# EAGLE design Printrhub_Rev_0.4 (EAGLE 7.5.0)
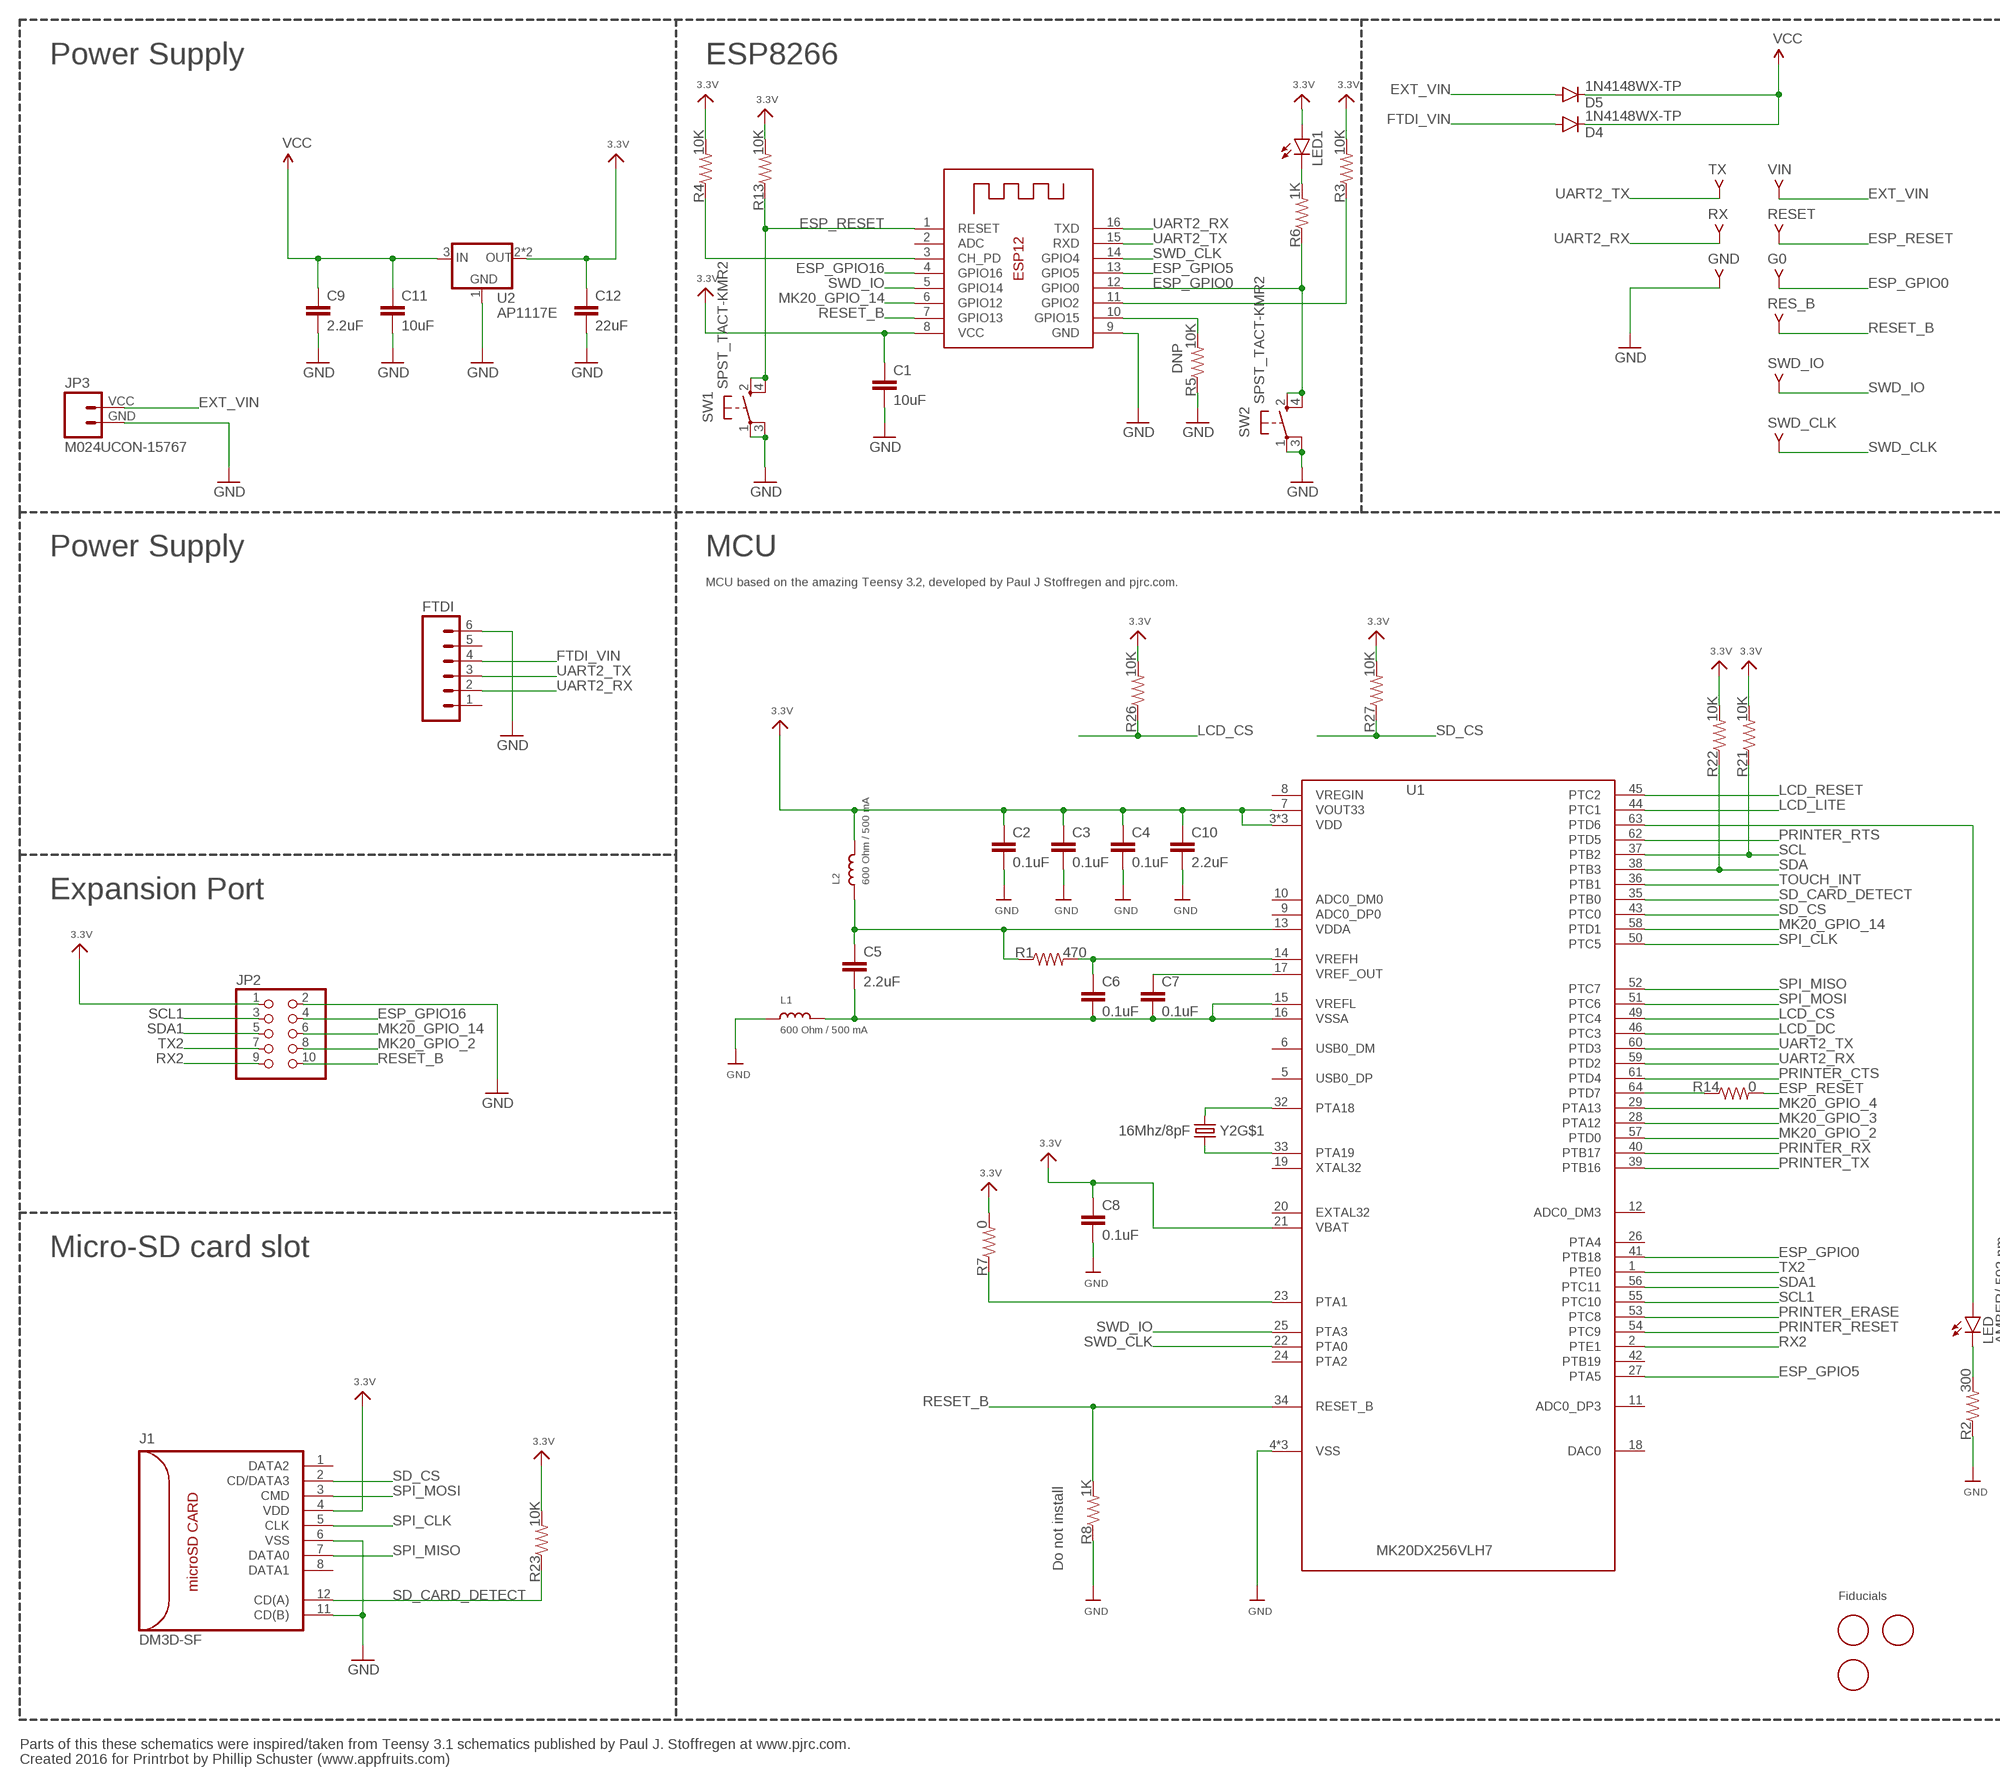
[diagram p0: schematic, sheet 1, part 1 of 2]
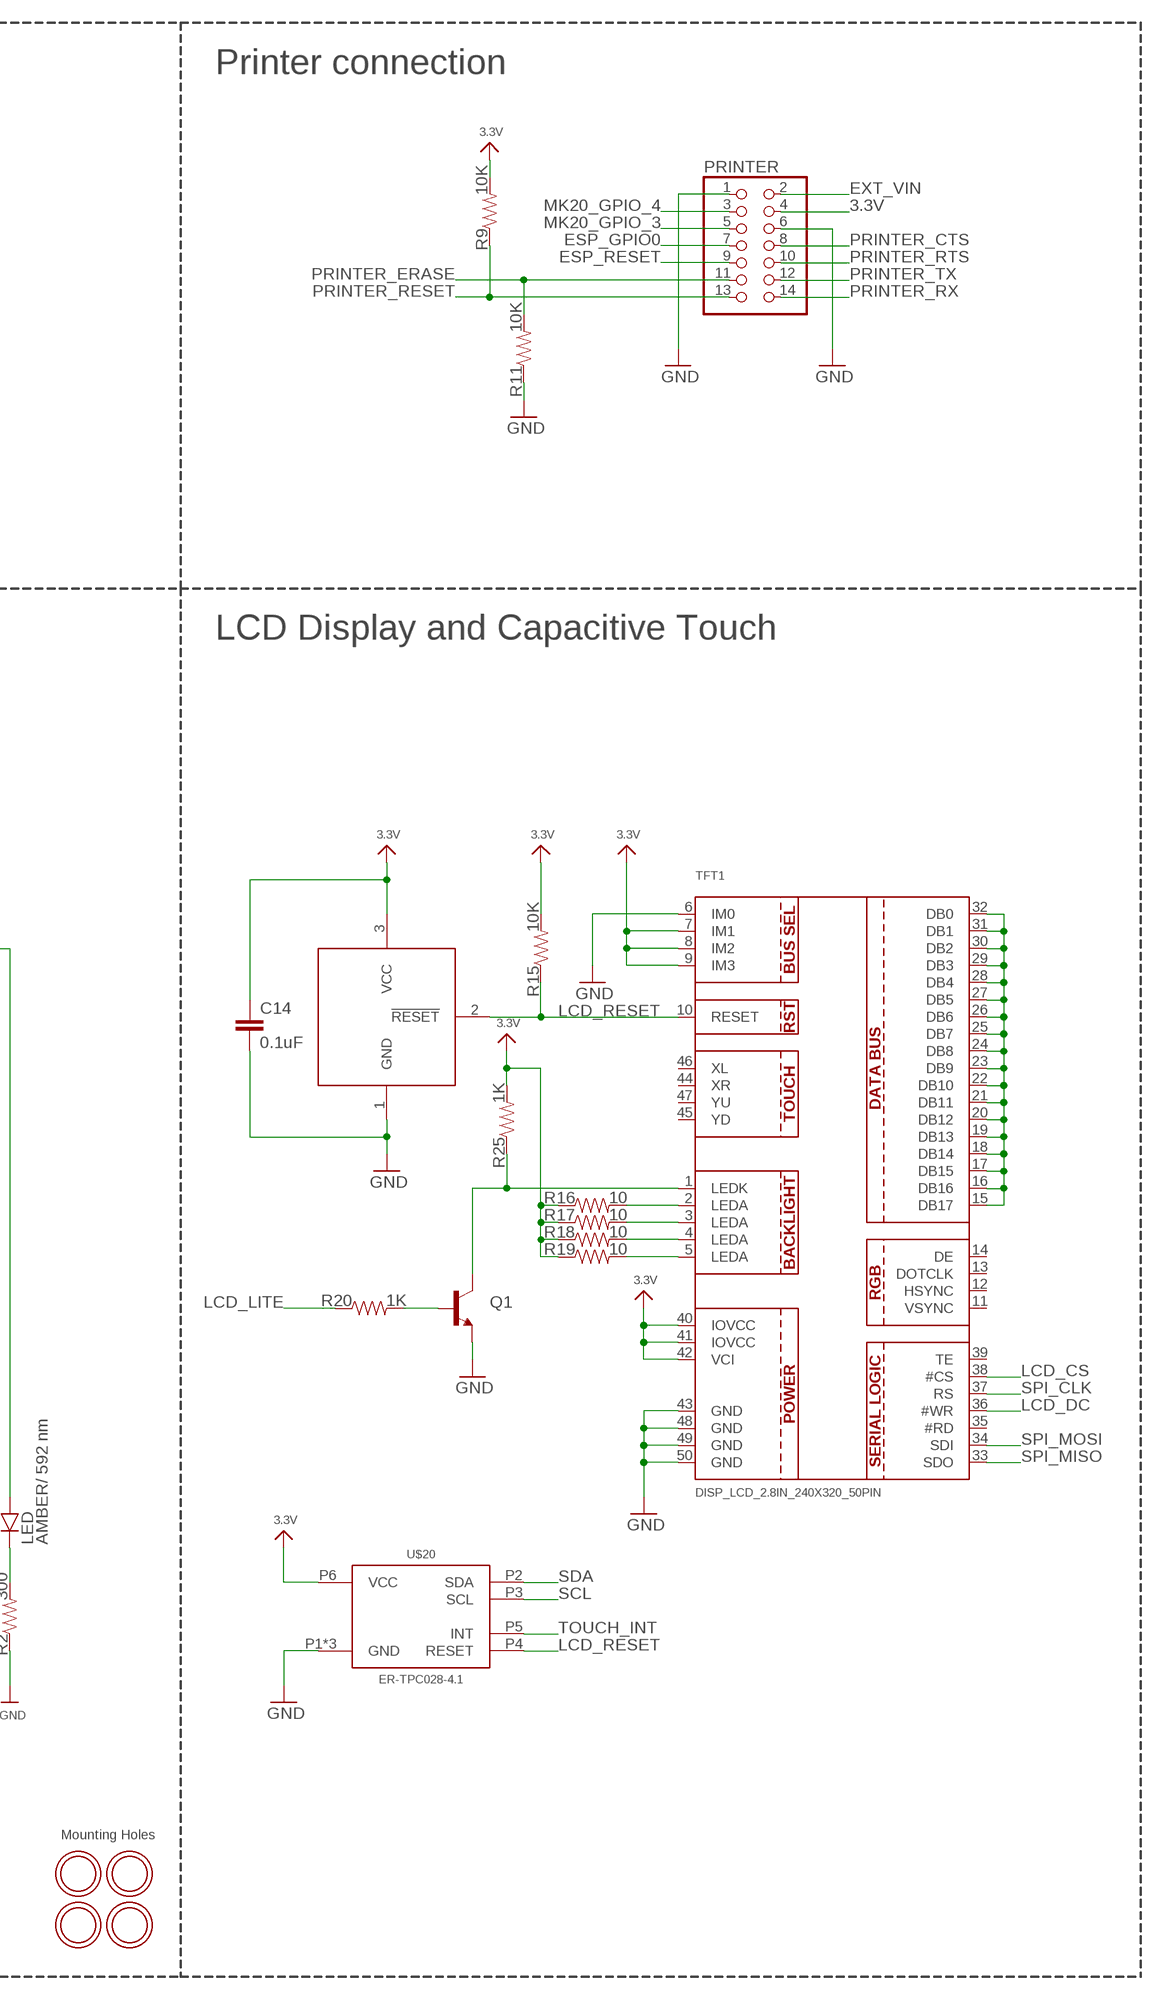
[diagram p1: schematic, sheet 1, part 2 of 2]

## Parts
C1  10uF  CAPACITOR-10UF  [0603-CAP]
C2  0.1uF  CAPACITOR-0.1UF  [0603-CAP]
C3  0.1uF  CAPACITOR-0.1UF  [0603-CAP]
C4  0.1uF  CAPACITOR-0.1UF  [0603-CAP]
C5  2.2uF  CAPACITOR-2.2UF  [0603-CAP]
C6  0.1uF  CAPACITOR-0.1UF  [0603-CAP]
C7  0.1uF  CAPACITOR-0.1UF  [0603-CAP]
C8  0.1uF  CAPACITOR-0.1UF  [0603-CAP]
C9  2.2uF  CAPACITOR-2.2UF  [0603-CAP]
C10  2.2uF  CAPACITOR-2.2UF  [0603-CAP]
C11  10uF  CAPACITOR-10UF  [0603-CAP]
C12  22uF  CAPACITOR-22UF  [0603-CAP]
C14  0.1uF  CAPACITOR-0.1UF  [0603-CAP]
D4  1N4148WX-TP  DIODESOD  [SOD-323]
D5  1N4148WX-TP  DIODESOD  [SOD-323]
FTDI  M06SMD-STRAIGHT-ALT  [1X06_SMD_STRAIGHT_ALT]
G0  TPV-SMD-18RN  [SMD-18RN]
GND  TPV-SMD-18RN  [SMD-18RN]
J1  DM3D-SF  [DM3D-SF]
JP2  PINHD-2X5SMT  [2X05_SMT]
JP3  M024UCON-15767  [JST-2-SMD-VERT]
L1  600 Ohm / 500 mA  INDUCTOR-0603_600OHM/500MA  [0603]
L2  600 Ohm / 500 mA  INDUCTOR-0603_600OHM/500MA  [0603]
LED  AMBER/ 592 nm  LED-AMBER  [LED-0603]
LED1  LED-GREEN  [LED-0603]
PRINTER  PINHD-2X7SMT  [2X07_SMT]
Q1  TRANSISTOR_NPNSOT23-3  [SOT23-3]
R1  470  RESISTOR-470  [0603-RES]
R2  300  RESISTOR0603  [0603-RES]
R3  10K  RESISTOR-10K  [0603-RES]
R4  10K  RESISTOR-10K  [0603-RES]
R5  10K  RESISTOR-10K  [0603-RES]
R6  1K  RESISTOR-1K  [0603-RES]
R7  0  RESISTOR-0  [0603-RES]
R8  1K  RESISTOR-1K  [0603-RES]
R9  10K  RESISTOR-10K  [0603-RES]
R11  10K  RESISTOR-10K  [0603-RES]
R13  10K  RESISTOR-10K  [0603-RES]
R14  0  RESISTOR-0  [0603-RES]
R15  10K  RESISTOR-10K  [0603-RES]
R16  10  RESISTOR-10  [0603-RES]
R17  10  RESISTOR-10  [0603-RES]
R18  10  RESISTOR-10  [0603-RES]
R19  10  RESISTOR-10  [0603-RES]
R20  1K  RESISTOR-1K  [0603-RES]
R21  10K  RESISTOR-10K  [0603-RES]
R22  10K  RESISTOR-10K  [0603-RES]
R23  10K  RESISTOR-10K  [0603-RES]
R25  1K  RESISTOR-1K  [0603-RES]
R26  10K  RESISTOR-10K  [0603-RES]
R27  10K  RESISTOR-10K  [0603-RES]
RES_B  TPV-SMD-18RN  [SMD-18RN]
RESET  TPV-SMD-18RN  [SMD-18RN]
RX  TPV-SMD-18RN  [SMD-18RN]
SW1  SPST_TACT-KMR2  [KMR2]
SW2  SPST_TACT-KMR2  [KMR2]
SWD_CLK  TPV-SMD-18RN  [SMD-18RN]
SWD_IO  TPV-SMD-18RN  [SMD-18RN]
TFT1  DISP_LCD_2.8IN_240X320_50PIN  [TFT_2.83IN_240X320_50PIN]
TX  TPV-SMD-18RN  [SMD-18RN]
U1  MK20DX256VLH7  [MK20DX256VLH7]
U2  AP1117E  [SOT223]
U3  MAX308-SOT23  [SOT23]
U$15  MOUNTINGHOLE  [HOLE_M3.0]
U$16  MOUNTINGHOLE  [HOLE_M3.0]
U$17  MOUNTINGHOLE  [HOLE_M3.0]
U$18  MOUNTINGHOLE  [HOLE_M3.0]
U$20  ER-TPC028-4.1  [ER-CON06HB-1]
U$38  FIDUCIAL  [FIDUCIAL_1MM]
U$39  FIDUCIAL  [FIDUCIAL_1MM]
U$40  FIDUCIAL  [FIDUCIAL_1MM]
VIN  TPV-SMD-18RN  [SMD-18RN]
X1  ESP-12  [ESP-12]
Y2  16Mhz/8pF  CRYSTAL/SMD-5X3-GND16MHZ/8PF  [CRYSTAL-SMD-5X3]

## Nets
3.3V: C1.1 C2.1 C3.1 C4.1 C8.1 C10.1 C12.1 C14.1 J1.4(VDD) JP2.1 L2.2 LED1.A PRINTER.4 R3.2 R4.2 R7.2 R9.2 R13.2 R15.2 R16.1 R17.1 R18.1 R19.1 R21.2 R22.2 R23.2 R25.2 R26.2 R27.2 TFT1.7(IM1) TFT1.8(IM2) TFT1.9(IM3) TFT1.40(IOVCC) TFT1.41(IOVCC) TFT1.42(VCI) U1.3(VDD) U1.7(VOUT33) U1.21(VBAT) U1.30(VDD) U1.48(VDD) U2.2(OUT) U2.4(OUT) U3.3(VCC) U$20.P6(VCC) X1.8(VCC)
ESP_GPIO0: G0.TP PRINTER.7 R6.1 SW2.2(S) SW2.4(S1) U1.41(PTB18) X1.12(GPIO0)
ESP_GPIO5: U1.27(PTA5) X1.13(GPIO5)
ESP_GPIO16: JP2.4 X1.4(GPIO16)
ESP_RESET: PRINTER.9 R13.1 R14.2 RESET.TP SW1.2(S) SW1.4(S1) X1.1(RESET)
EXT_VIN: D5.A JP3.VCC PRINTER.2 VIN.TP
FTDI_VIN: D4.A FTDI.4
GND [Top GND Pour]: C1.2 C2.2 C3.2 C4.2 C8.2 C9.2 C10.2 C11.2 C12.2 C14.2 FTDI.6 GND.TP J1.6(VSS) J1.11(CD(B)) JP2.2 JP3.GND L1.1 PRINTER.1 PRINTER.6 Q1.2(E) R2.1 R5.1 R8.1 R11.1 SW1.1(P) SW1.3(P1) SW2.1(P) SW2.3(P1) TFT1.6(IM0) TFT1.43(GND) TFT1.48(GND) TFT1.49(GND) TFT1.50(GND) U1.4(VSS) U1.31(VSS) U1.47(VSS) U2.1(GND) U3.1(GND) U$20.P1(GND) U$20.PAD@0(GND) U$20.PAD@1(GND) X1.9(GND)
LCD_CS: R26.1 TFT1.38(#CS) U1.49(PTC4)
LCD_DC: TFT1.36(#WR) U1.46(PTC3)
LCD_LITE: R20.1 U1.44(PTC1)
LCD_RESET: R15.1 TFT1.10(RESET) U1.45(PTC2) U3.2(!RESET) U$20.P4(RESET)
MK20_GPIO_2: JP2.8 U1.57(PTD0)
MK20_GPIO_3: PRINTER.5 U1.28(PTA12)
MK20_GPIO_4: PRINTER.3 U1.29(PTA13)
MK20_GPIO_14: JP2.6 U1.58(PTD1) X1.6(GPIO12)
N$1: R14.1 U1.64(PTD7)
N$2: R5.2 X1.10(GPIO15)
N$3: R7.1 U1.23(PTA1)
N$4: R3.1 X1.11(GPIO2)
N$5: R4.1 X1.3(CH_PD)
N$7: LED1.C R6.2
N$10: Q1.3(C) R25.1 TFT1.1(LEDK)
N$11: R16.2 TFT1.2(LEDA)
N$12: LED.A U1.63(PTD6)
N$13: R17.2 TFT1.3(LEDA)
N$14: R18.2 TFT1.4(LEDA)
N$15: R19.2 TFT1.5(LEDA)
N$16: Q1.1(B) R20.2
N$17: TFT1.15(DB17) TFT1.16(DB16) TFT1.17(DB15) TFT1.18(DB14) TFT1.19(DB13) TFT1.20(DB12) TFT1.21(DB11) TFT1.22(DB10) TFT1.23(DB9) TFT1.24(DB8) TFT1.25(DB7) TFT1.26(DB6) TFT1.27(DB5) TFT1.28(DB4) TFT1.29(DB3) TFT1.30(DB2) TFT1.31(DB1) TFT1.32(DB0)
N$18: LED.C R2.2
N$27: U1.32(PTA18) Y2.3
N$28: U1.33(PTA19) Y2.1
PRINTER_CTS: PRINTER.8 U1.61(PTD4)
PRINTER_ERASE: PRINTER.11 R11.2 U1.53(PTC8)
PRINTER_RESET: PRINTER.13 R9.1 U1.54(PTC9)
PRINTER_RTS: PRINTER.10 U1.62(PTD5)
PRINTER_RX: PRINTER.14 U1.40(PTB17)
PRINTER_TX: PRINTER.12 U1.39(PTB16)
RESET_B: JP2.10 R8.2 RES_B.TP U1.34(RESET_B) X1.7(GPIO13)
RX2: JP2.9 U1.2(PTE1)
SCL: R21.1 U1.37(PTB2) U$20.P3(SCL)
SCL1: JP2.3 U1.55(PTC10)
SD_CARD_DETECT: J1.12(CD(A)) R23.1 U1.35(PTB0)
SD_CS: J1.2(CD/DATA3) R27.1 U1.43(PTC0)
SDA: R22.1 U1.38(PTB3) U$20.P2(SDA)
SDA1: JP2.5 U1.56(PTC11)
SPI_CLK: J1.5(CLK) TFT1.37(RS) U1.50(PTC5)
SPI_MISO: J1.7(DATA0) TFT1.33(SDO) U1.52(PTC7)
SPI_MOSI: J1.3(CMD) TFT1.34(SDI) U1.51(PTC6)
SWD_CLK: SWD_CLK.TP U1.22(PTA0) X1.14(GPIO4)
SWD_IO: SWD_IO.TP U1.25(PTA3) X1.5(GPIO14)
TOUCH_INT: U1.36(PTB1) U$20.P5(INT)
TX2: JP2.7 U1.1(PTE0)
UART2_RX: FTDI.2 RX.TP U1.59(PTD2) X1.16(TXD)
UART2_TX: FTDI.3 TX.TP U1.60(PTD3) X1.15(RXD)
VCC: C9.1 C11.1 D4.C D5.C U2.3(IN)
VDDA: C5.1 L2.1 R1.1 U1.13(VDDA)
VREF_OUT: C7.1 U1.17(VREF_OUT)
VREFH: C6.1 R1.2 U1.14(VREFH)
VREFL: C5.2 C6.2 C7.2 L1.2 U1.15(VREFL) U1.16(VSSA)
Unconnected: FTDI.1 FTDI.5 J1.1(DATA2) J1.8(DATA1) J1.9(GND) J1.10(GND) J1.13(GND) J1.14(GND) TFT1.11(VSYNC) TFT1.12(HSYNC) TFT1.13(DOTCLK) TFT1.14(DE) TFT1.35(#RD) TFT1.39(TE) TFT1.44(XR) TFT1.45(YD) TFT1.46(XL) TFT1.47(YU) U1.5(USB0_DP) U1.6(USB0_DM) U1.8(VREGIN) U1.9(ADC0_DP0) U1.10(ADC0_DM0) U1.11(ADC0_DP3) U1.12(ADC0_DM3) U1.18(DAC0) U1.19(XTAL32) U1.20(EXTAL32) U1.24(PTA2) U1.26(PTA4) U1.42(PTB19) X1.2(ADC) Y2.2(GND:GND) Y2.4(GND:GND)

## Notes on the sheet
- Power Supply | ESP8266 | Printer connection
- DNP
- Power Supply | MCU | LCD Display and Capacitive Touch
- MCU based on the amazing Teensy 3.2, developed by Paul J Stoffregen and pjrc.com.
- Expansion Port
- Micro-SD card slot
- Do not install
- Fiducials | Mounting Holes
- Parts of this these schematics were inspired/taken from Teensy 3.1 schematics published by Paul J. Stoffregen at www.pjrc.com.
- Created 2016 for Printrbot by Phillip Schuster (www.appfruits.com)

## Library data of the parts
C1 C11 = appfruits:CAPACITOR; MF: Murata; MPN: GRM188R60J106ME47D
C2-C4 C6-C8 C14 = appfruits:CAPACITOR; MF: Kemet; MPN: C0603C104J3RACTU
C5 C9 C10 = appfruits:CAPACITOR; MF: Kemet; MPN: C0603C225K4PACTU
C12 = appfruits:CAPACITOR; MF: Murata; MPN: GRM188R60J226MEA0D
D4 D5 = SparkFun-DiscreteSemi:DIODE: Diode These are standard reverse protection diodes and small signal diodes. SMA package can handle up to about 1A. SOD-323 can handle about 200mA. What the SOD-323 package when ordering, there are some mfgs out there that are 5-pin packages.; MF: Micro Commercial Co; MPN: 1N4148WX-TP; PROD_ID: DIO-09646
FTDI = appfruits:M06: Header 6 Standard 6-pin 0.1" header. Use with straight break away headers (SKU : PRT-00116), right angle break away headers (PRT-00553), swiss pins (PRT-00743), machine pins (PRT-00117), and female headers (PRT-00115). Molex polarized connector foot print use with SKU : PRT-08094 with associated crimp pins and housings. NOTES ON THE VARIANTS LOCK and LOCK_LONGPADS... This footprint was designed to help hold the alignment of a through-hole component (i.e. 6-pin header) while soldering it into place. You may notice that each hole has been shifted either up or down by 0.005 of an inch from it's more standard position (which is a perfectly straight line). This slight alteration caused the pins (the squares in the middle) to touch the edges of the holes. Because they are alternating, it causes a "brace" to hold the component in place. 0.005 has proven to be the perfect amount of "off-center" position when using our standard breakaway headers. Although looks a little odd when you look at the bare footprint, once you have a header in there, the alteration is very hard to notice. Also,if you push a header all the way into place, it is covered up entirely on the bottom side. This idea of altering the position of holes to aid alignment will be further integrated into the Sparkfun Library for other footprints. It can help hold any component with 3 or more connection pins.
G0 GND RES_B RESET RX SWD_CLK SWD_IO TX VIN = appfruits:TPV: TEST POINT PAD; BOM: EXCLUDE
J1 = con-sd-card:DM3D-SF: MICRO SD CONNECTOR
JP2 = pinhead+:PINHD-2X5: PIN HEADER
JP3 = SparkFun-Connectors:M02: Standard 2-pin 0.1" header. Use with - straight break away headers ( PRT-00116) - right angle break away headers (PRT-00553) - swiss pins (PRT-00743) - machine pins (PRT-00117) - female headers (PRT-00115) Molex polarized connector foot print use with: PRT-08233 with associated crimp pins and housings. 2.54_SCREWTERM for use with PRT-10571. 3.5mm Screw Terminal footprints for PRT-08084 5mm Screw Terminal footprints for use with PRT-08432
L1 L2 = appfruits:INDUCTOR: Inductors 0603: 10nH Ceramic Inductor - microwire antenna/RF (Digikey: 712-1434-2-ND) 0805: 560nH Ceramic Inductor - RF (Digikey: 553-1047-1-ND) 270nH Ceramic Inductor - Q = 40@250MHz, +-5%, 1 Ohm DC Resistance (Digikey: 535-10506-2-ND) 1007 (2518 Metric) SMT: 10µH 10% 250mOhm 820mA 1007 Inductor (Digikey: 587-2189-1-ND) 22µH 10% 500mOhm 580mA 1007 Inductor (Digikey: 587-2190-1-ND) 47µH 10% 950mOhm 420mA 1007 Inductor (Digikey: 587-2191-1-ND) 47µH 5% 100mOhm 1A 1008 Inductor (Digikey: 732-1816-1-ND) 5.0x5.0mm (Taiyo Yuden NR5040 Series) 6.8µH 20% 2.3A 64mOhm Inductor (Digikey: 587-2374-2-ND) 5.0x5.0mm (TDK VLC5045 Series) 4.7µH 20% 3.3A 34mOhm Inductor (Digikey: 445-6526-1-ND) 6.8µH 20% 2.7A 46mOhm Inductor (Digikey: 445-6527-1-ND) 6.0x6.0mm (TDK VLC6045 Series) 4.7µH 20% 3.8A 27mOhm Inductor (Digikey: 445-6538-2-ND) 6.8µH 20% 3A 41mOhm Inductor (Digikey: 445-6540-1-ND) 6.2µH 30% 2.2A 45mOhm Inductor (Digikey: SRR5028-6R2YCT-ND) - Not TDK VLC6045 but footprint should match 6.0x6.0mm (TDK SLF6045 Series) 6.8uH 30% 2A 33mOhm Inductor (Digikey: 445-4572-1-ND, Mouser: 810-SLF645T6R8N2R0PF) 6.0x6.0mm (Sumida CDRH5D28 Series) 6.2uH 30% 1.8A 45mOhm Inductor (Digikey: 308-1542-1-ND) Taiyo Yuden NR3015T2R2M - 2.2uH 20% 1.5A (Digikey: 587-1648-2-ND, Mouser: 963-NR3015T2R2M) - Used with TI TPS62172 CoilCraft RFID Transponder Coil - MA5532-AE (For use with AS3935 Lightning Sensor); MF: Murata; MPN: BLM18AG601SN1D
LED = appfruits:LED: LEDs Standard schematic elements and footprints for 5mm, 3mm, 1206, and 0603 sized LEDs. 5mm - Spark Fun Electronics SKU : COM-00529 (and others); MF: Avago Technologies; MPN: HSMA-C190
LED1 = appfruits:LED: LEDs Standard schematic elements and footprints for 5mm, 3mm, 1206, and 0603 sized LEDs. 5mm - Spark Fun Electronics SKU : COM-00529 (and others); MF: Avago; MPN: HSMG-C190
PRINTER = pinhead+:PINHD-2X7: PIN HEADER
Q1 = appfruits:TRANSISTOR_NPN: Generic NPN BJT MMBT2222A - TRANS-08049 (SOT-23, 1A 40V) MPSA42 - TRANS-09116 (SOT-23, 500mA 300V) MMBT5088LT1G - TRANS-11160 (SOT-23, 50 mA 30V) BC547 - COM-08928 <http://www.sparkfun.com/products/8928> (TO-92 45V 100mA) (1.Collector 2.Base 3.Emitter) 2N3904 - COM-00521 <http://www.sparkfun.com/products/521> (TO-92 40V 200mA) (1.Emitter 2.Base 3.Collector) P2N2222A - COM-12852 <http://www.sparkfun.com/products/12852> (TO-92 40V 600mA) (1.Collector 2.Base 3.Emitter); MF: ON Semiconductor; MPN: MMBT2222ALT1G
R1 = appfruits:RESISTOR: Resistor Basic schematic elements and footprints for 0603, 1206, and PTH resistors.; MF: Panasonic; MPN: ERJ-3GEYJ471V
R2 = appfruits:RESISTOR: Resistor Basic schematic elements and footprints for 0603, 1206, and PTH resistors.
R3-R5 R9 R11 R13 R15 R21-R23 R26 R27 = appfruits:RESISTOR: Resistor Basic schematic elements and footprints for 0603, 1206, and PTH resistors.; MF: Panasonic; MPN: ERJ-3GEYJ103V
R6 R8 R20 R25 = appfruits:RESISTOR: Resistor Basic schematic elements and footprints for 0603, 1206, and PTH resistors.; MF: Panasonic; MPN: ERJ-3GEYJ102V
R7 R14 = appfruits:RESISTOR: Resistor Basic schematic elements and footprints for 0603, 1206, and PTH resistors.; MF: Panasonic; MPN: ERJ-3GEY0R00V
R16-R19 = appfruits:RESISTOR: Resistor Basic schematic elements and footprints for 0603, 1206, and PTH resistors.; MF: Panasonic; MPN: ERJ-3EKF10R0V
SW1 SW2 = adafruit:SPST_TACT: SMT 6mm switch, EVQQ2 series http://www.ladyada.net/library/eagle
TFT1 = appfruits:DISP_LCD_2.8IN_240X320_50PIN
U1 = appfruits:MK20DX256VLH7; MF: Freescale; MPN: MK20DX256VLH7
U2 = v-reg:AP1117: LDO Regulator
U3 = appfruits:MAX308: Reset Monitor for various drop voltages
U$15-U$18 = appfruits:MOUNTINGHOLE
U$20 = appfruits:ER-TPC028-4.1: Connector for ER-TFT028-4 capacitive touch screen controller (buydisplay.com)
U$38-U$40 = adafruit:FIDUCIAL: For use by pick and place machines to calibrate the vision/machine, 1mm By microbuilder.eu
X1 = adafruit:ESP-12
Y2 = appfruits:CRYSTAL/SMD-5X3-GND; MF: ECS; MPN: ECS-160-8-30B-CKM

## Net classes
1 USB: width 0.267 mm, drill 0.33 mm, clearance 0.159 mm
2 Top GND Pour: clearance 0.762 mm to class 1

## Board
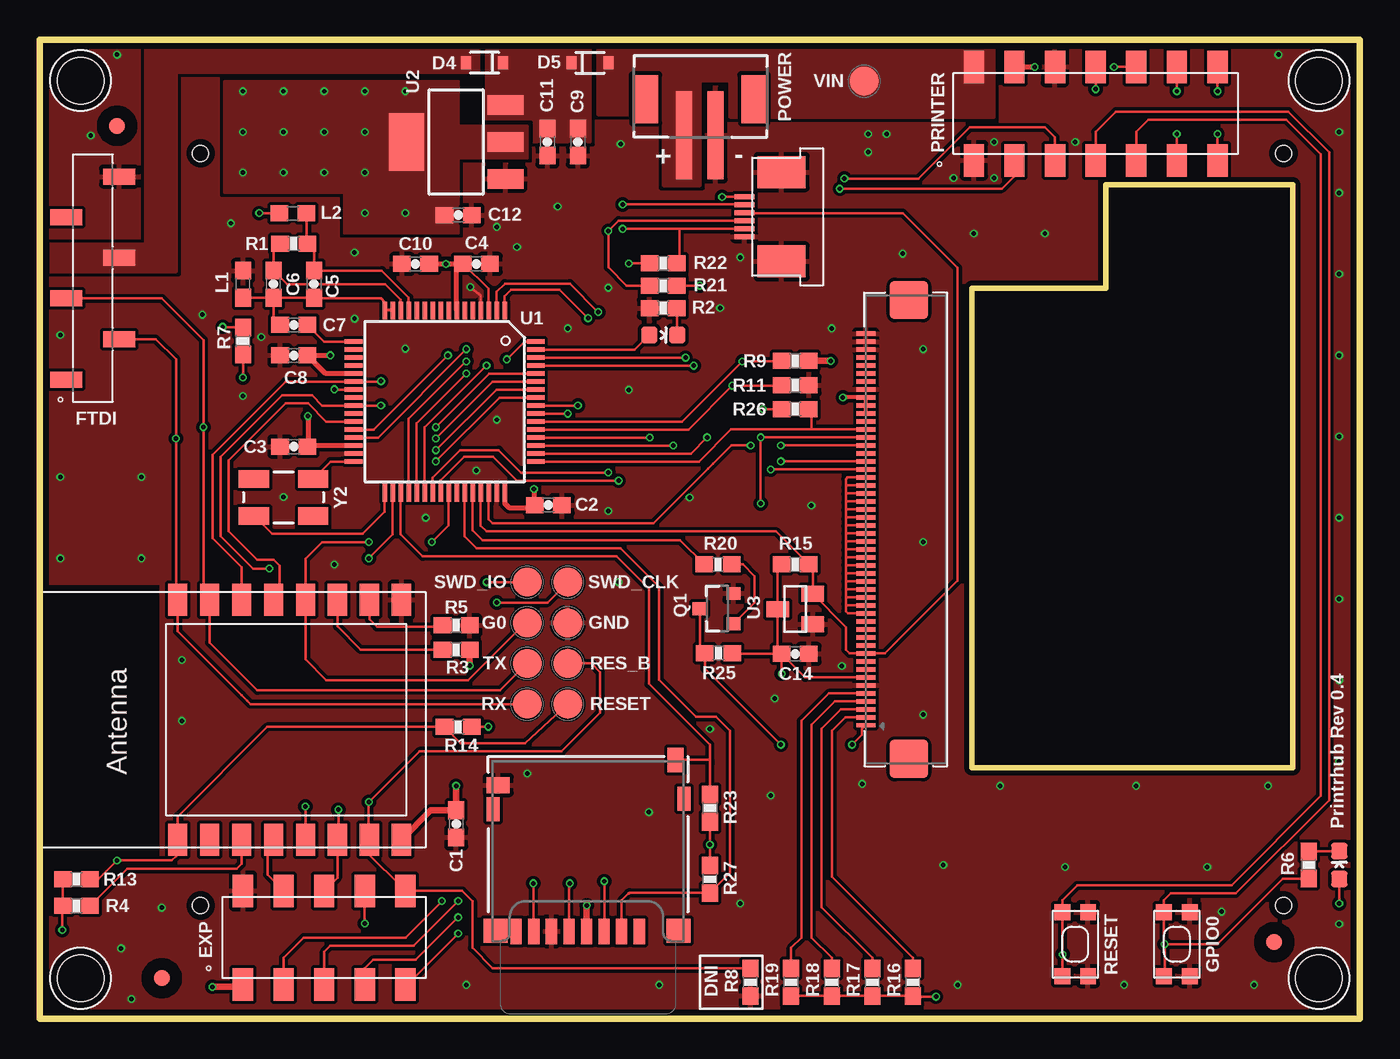
[diagram p2: board, top side]
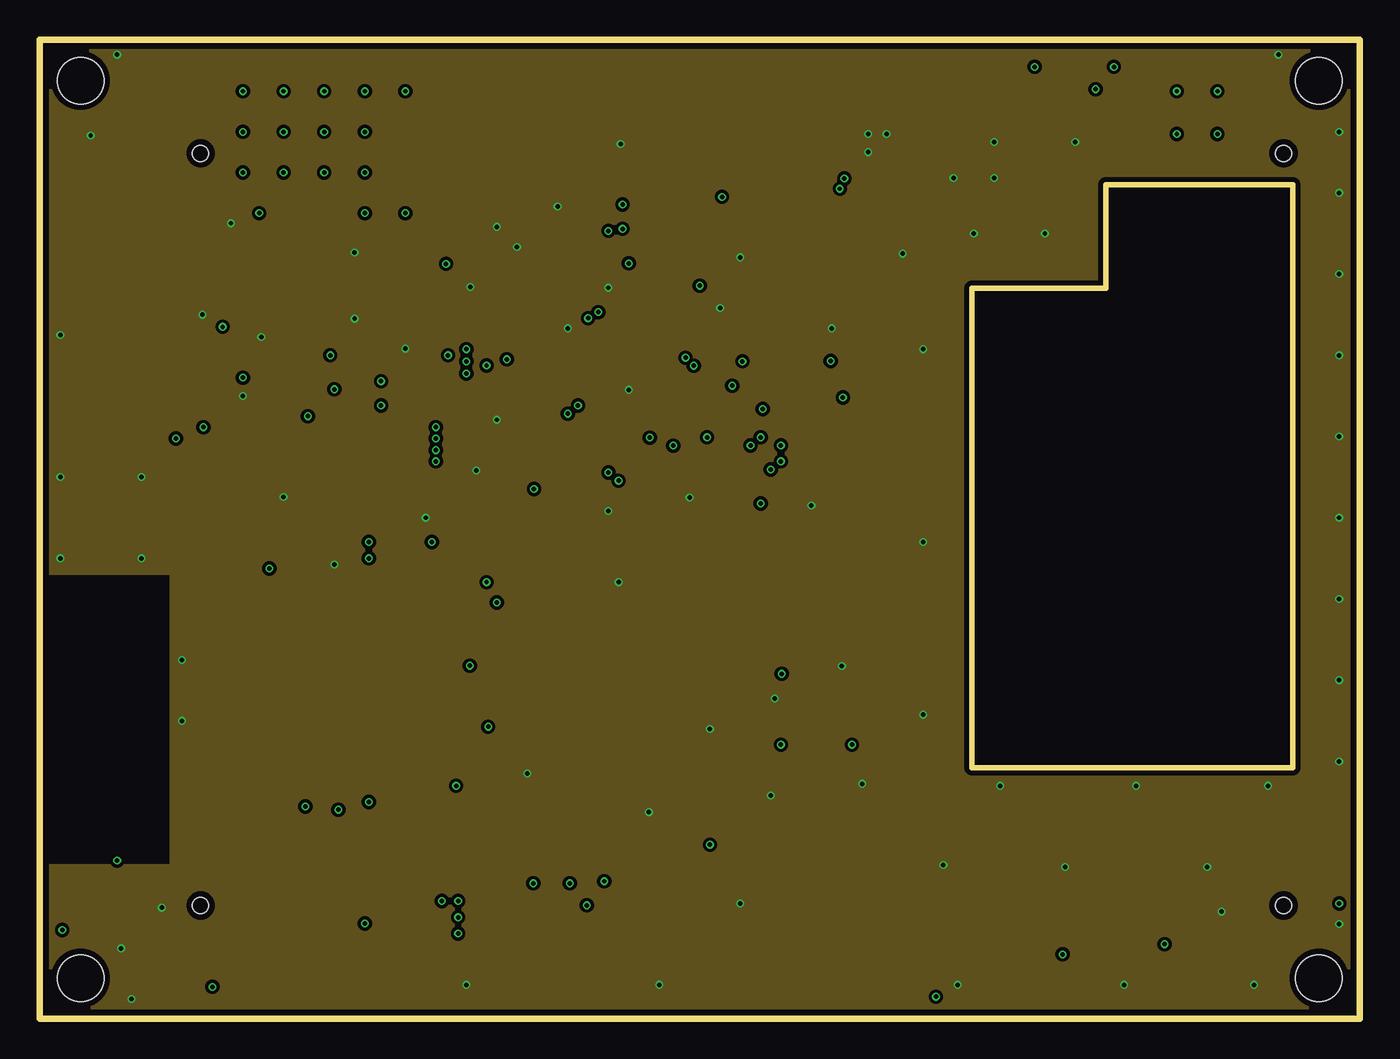
[diagram p3: board, inner layer GND]
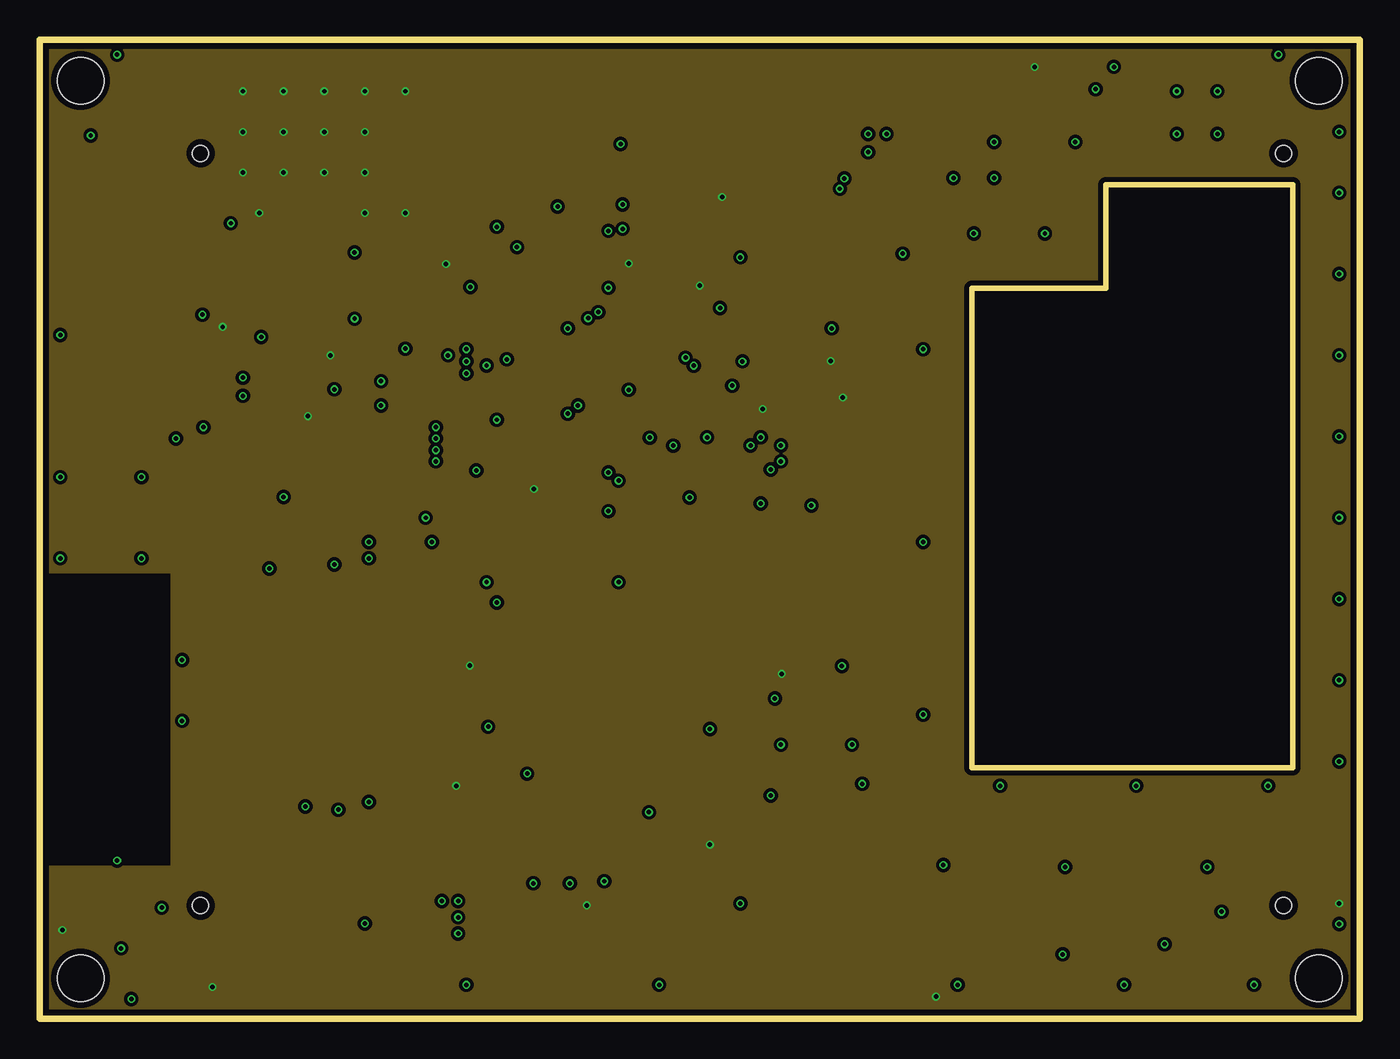
[diagram p4: board, inner layer 3V3]
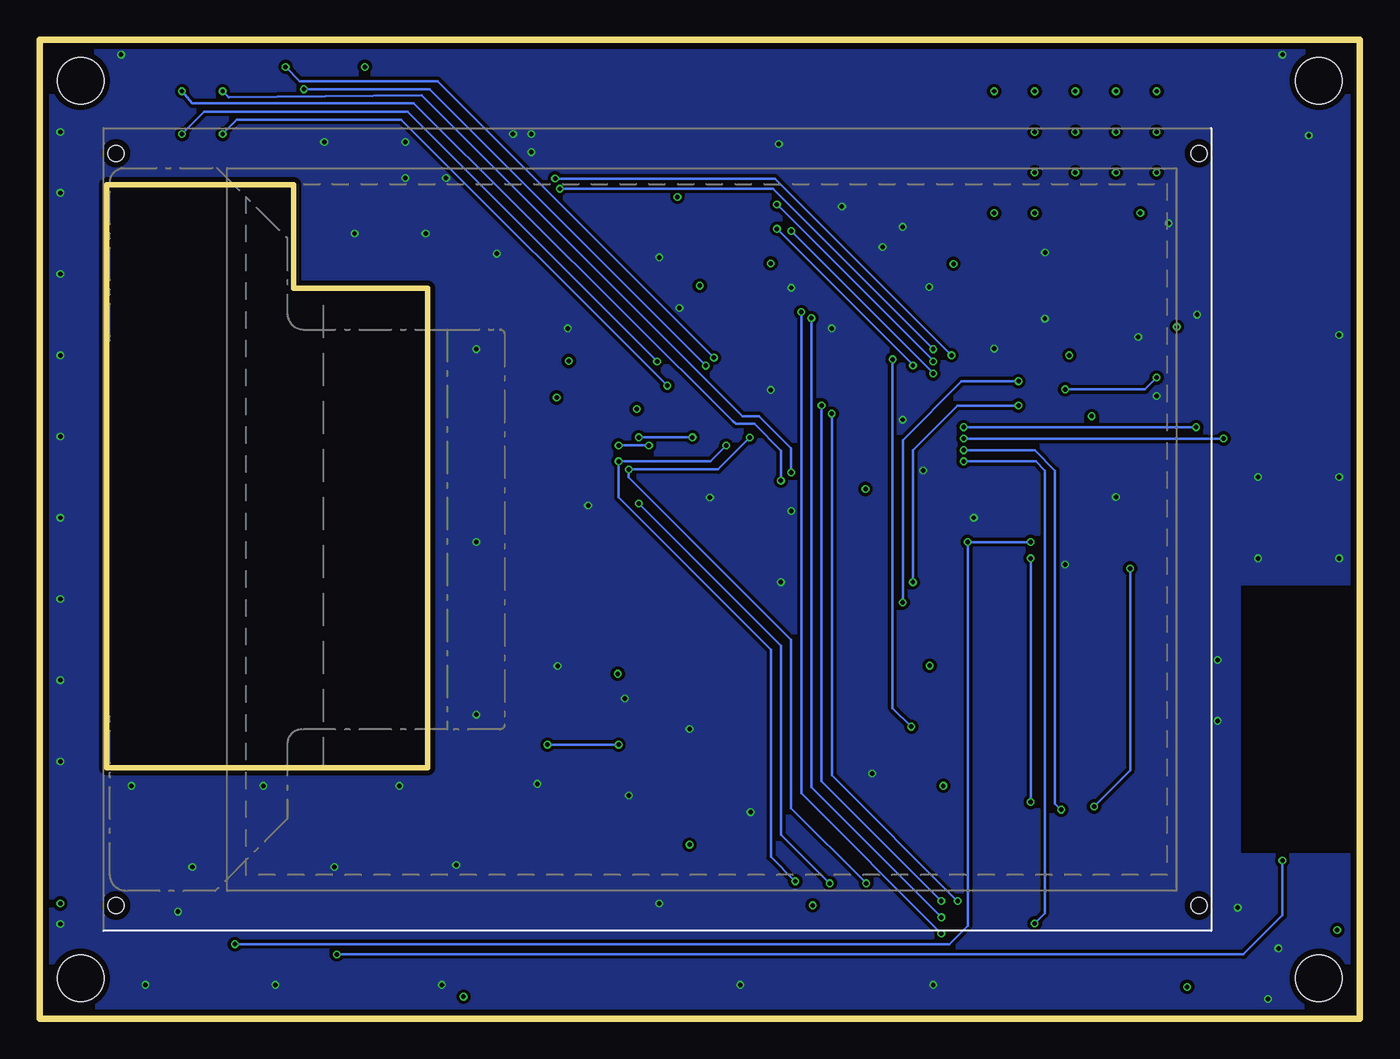
[diagram p5: board, bottom side, seen from below]

Size 82.55 x 61.21 mm. Coordinates in mm from the lower left corner, seen from the top.
Outline: 0,0 82.55,0 82.55,61.21 0,61.21 0,0
Outline: 58.29,15.72 78.36,15.72 78.36,52.16 66.67,52.16 66.67,45.69 58.29,45.69 58.29,15.72
Copper layers (1*2*15*16): Top 0.035559375mm / dielectric 0.17018125mm / GND 0.01778125mm / dielectric 47mil / 3V3 0.01778125mm / dielectric 0.17018125mm / Bottom 0.035559375mm
Design rules "OSHPark-4layer *": minimum track width 5mil, minimum drill 10mil, track to track 5mil, track to pad 5mil, pad to pad 5mil, via to via 5mil, smd to smd 5mil, copper to edge 15mil, drill to drill 6mil, minimum pad ring 4mil, minimum via ring 4mil, stop-mask expansion 4mil, vias tented up to drill 11mil, thermal gap 10mil
Milling: area 58.3,15.7 to 78.4,52.2

### Footprints (pad centres in the part's own frame; a part is rotated, then mirrored left to right if it is on the bottom)
0603-CAP = smd 1.1 x 1: 1 -0.85,0; 2 0.85,0
SOD-323 = smd 0.63 x 0.83: A 1.15,0; C -1.15,0
1X06_SMD_STRAIGHT_ALT = smd 1 x 2: 1 0,-1.65; 2 -2.54,1.65; 3 -5.08,-1.65; 4 -7.62,1.65; 5 -10.16,-1.65; 6 -12.7,1.65
SMD-18RN = smd 1.8 x 1.8: TP 0,0
DM3D-SF = smd 0.7 x 1.6: 1 3.2,0.8; 2 2.1,0.8; 3 1,0.8; 4 -0.1,0.8; 5 -1.2,0.8; 6 -2.3,0.8; 7 -3.4,0.8; 8 -4.5,0.8 | smd 1.5 x 1.5: 9 -5.8,0.85; 14 5.65,0.85 | smd 0.8 x 1.5: 10 -5.95,8.45; 13 6,9.1 | smd 1.45 x 1: 11 -5.625,9.95 | smd 1 x 1.55: 12 5.475,11.525
2X05_SMT = smd 1.27 x 2.032: 1 -5.08,-2.921; 2 -5.08,2.921; 3 -2.54,-2.921; 4 -2.54,2.921; 5 0,-2.921; 6 0,2.921; 7 2.54,-2.921; 8 2.54,2.921; 9 5.08,-2.921; 10 5.08,2.921
JST-2-SMD-VERT = smd 1 x 5.5: GND 1,-2; VCC -1,-2 | smd 1.6 x 3: P$1 -3.4,0.27; P$2 3.4,0.27
0603 = smd 1.1 x 1: 1 -0.85,0; 2 0.85,0
LED-0603 = smd 1 x 1: A 0,-0.877; C 0,0.877
2X07_SMT = smd 1.27 x 2.032: 1 -7.62,-2.921; 2 -7.62,2.921; 3 -5.08,-2.921; 4 -5.08,2.921; 5 -2.54,-2.921; 6 -2.54,2.921; 7 0,-2.921; 8 0,2.921; 9 2.54,-2.921; 10 2.54,2.921; 11 5.08,-2.921; 12 5.08,2.921; 13 7.62,-2.921; 14 7.62,2.921
SOT23-3 = smd 0.8 x 0.9: 1 -0.95,-1; 2 0.95,-1; 3 0,1.1
0603-RES = smd 1.1 x 1: 1 -0.85,0; 2 0.85,0
KMR2 = smd 1 x 1: 1 2,0.8; 2 2,-0.8; 3 -2,0.8; 4 -2,-0.8
TFT_2.83IN_240X320_50PIN = smd 0.275 x 1.2 bottom: 1 12.25,-10.39; 2 11.75,-10.39; 3 11.25,-10.39; 4 10.75,-10.39; 5 10.25,-10.39; 6 9.75,-10.39; 7 9.25,-10.39; 8 8.75,-10.39; 9 8.25,-10.39; 10 7.75,-10.39; 11 7.25,-10.39; 12 6.75,-10.39; 13 6.25,-10.39; 14 5.75,-10.39; 15 5.25,-10.39; 16 4.75,-10.39; 17 4.25,-10.39; 18 3.75,-10.39; 19 3.25,-10.39; 20 2.75,-10.39; 21 2.25,-10.39; 22 1.75,-10.39; 23 1.25,-10.39; 24 0.75,-10.39; 25 0.25,-10.39; 26 -0.25,-10.39; 27 -0.75,-10.39; 28 -1.25,-10.39; 29 -1.75,-10.39; 30 -2.25,-10.39; 31 -2.75,-10.39; 32 -3.25,-10.39; 33 -3.75,-10.39; 34 -4.25,-10.39; 35 -4.75,-10.39; 36 -5.25,-10.39; 37 -5.75,-10.39; 38 -6.25,-10.39; 39 -6.75,-10.39; 40 -7.25,-10.39; 41 -7.75,-10.39; 42 -8.25,-10.39; 43 -8.75,-10.39; 44 -9.25,-10.39; 45 -9.75,-10.39; 46 -10.25,-10.39; 47 -10.75,-10.39; 48 -11.25,-10.39; 49 -11.75,-10.39; 50 -12.25,-10.39 | smd 2.4 x 2.4 bottom: PAD1 14.35,-13.09; PAD2 -14.35,-13.09 | hole 1: 23.52,-36.525; 23.52,31.225; -23.52,31.225; -23.52,-36.525
MK20DX256VLH7 = smd 1.1 x 0.285: 1 -5.7,3.75; 2 -5.7,3.25; 3 -5.7,2.75; 4 -5.7,2.25; 5 -5.7,1.75; 6 -5.7,1.25; 7 -5.7,0.75; 8 -5.7,0.25; 9 -5.7,-0.25; 10 -5.7,-0.75; 11 -5.7,-1.25; 12 -5.7,-1.75; 13 -5.7,-2.25; 14 -5.7,-2.75; 15 -5.7,-3.25; 16 -5.7,-3.75; 33 5.7,-3.75; 34 5.7,-3.25; 35 5.7,-2.75; 36 5.7,-2.25; 37 5.7,-1.75; 38 5.7,-1.25; 39 5.7,-0.75; 40 5.7,-0.25; 41 5.7,0.25; 42 5.7,0.75; 43 5.7,1.25; 44 5.7,1.75; 45 5.7,2.25; 46 5.7,2.75; 47 5.7,3.25; 48 5.7,3.75 | smd 0.285 x 1.1: 17 -3.75,-5.7; 18 -3.25,-5.7; 19 -2.75,-5.7; 20 -2.25,-5.7; 21 -1.75,-5.7; 22 -1.25,-5.7; 23 -0.75,-5.7; 24 -0.25,-5.7; 25 0.25,-5.7; 26 0.75,-5.7; 27 1.25,-5.7; 28 1.75,-5.7; 29 2.25,-5.7; 30 2.75,-5.7; 31 3.25,-5.7; 32 3.75,-5.7; 49 3.75,5.7; 50 3.25,5.7; 51 2.75,5.7; 52 2.25,5.7; 53 1.75,5.7; 54 1.25,5.7; 55 0.75,5.7; 56 0.25,5.7; 57 -0.25,5.7; 58 -0.75,5.7; 59 -1.25,5.7; 60 -1.75,5.7; 61 -2.25,5.7; 62 -2.75,5.7; 63 -3.25,5.7; 64 -3.75,5.7
SOT223 = smd 1.219 x 2.235: 1 -2.311,-3.099; 2 0,-3.099; 3 2.311,-3.099 | smd 3.6 x 2.2: 4 0,3.099
SOT23 = smd 1 x 1.4: 1 -0.95,-1.1; 2 0.95,-1.1; 3 0,1.1
HOLE_M3.0 = hole 2.9: 0,0
ER-CON06HB-1 = smd 0.3 x 1.25: P1 -1.25,0; P2 -0.75,0; P3 -0.25,0; P4 0.25,0; P5 0.75,0; P6 1.25,0 | smd 2 x 3: PAD@0 -2.79,-2.325; PAD@1 2.79,-2.325
FIDUCIAL_1MM = smd 1 x 1: 1 0,0
ESP-12 = smd 2 x 1.2: 1 -7.5,4.5; 2 -7.5,2.5; 3 -7.5,0.5; 4 -7.5,-1.5; 5 -7.5,-3.5; 6 -7.5,-5.5; 7 -7.5,-7.5; 8 -7.5,-9.5; 9 7.5,-9.5; 10 7.5,-7.5; 11 7.5,-5.5; 12 7.5,-3.5; 13 7.5,-1.5; 14 7.5,0.5; 15 7.5,2.5; 16 7.5,4.5
CRYSTAL-SMD-5X3 = smd 1.9 x 1.1: 1 -1.85,-1.15; 2 1.85,-1.15; 3 1.85,1.15; 4 -1.85,1.15

### Placement (x,y rotation side)
C1  26.04,12.19 270 top
C2  31.8,32.12 0 top
C3  15.88,35.78 180 top
C4  27.3,47.21 0 top
C5  17.14,45.94 270 top
C6  14.61,45.94 270 top
C7  15.88,43.4 180 top
C8  15.88,41.5 180 top
C9  33.66,54.83 270 top
C10  23.5,47.21 180 top
C11  31.75,54.83 270 top
C12  26.16,50.26 0 top
C14  47.24,22.83 0 top
D4  27.81,59.78 180 top
D5  34.42,59.78 0 top
FTDI  3.3,39.97 270 top
G0  30.48,24.77 0 top
GND  33.02,24.77 0 top
J1  34.29,4.67 0 top
JP2  17.78,5.08 0 top
JP3  41.27,57.24 0 top
L1  12.7,45.94 270 top
L2  15.83,50.37 180 top
LED  38.99,42.77 270 top
LED1  81.28,9.62 0 top
PRINTER  66.04,56.61 0 top
Q1  42.39,25.65 90 top
R1  15.88,48.48 180 top
R2  38.99,44.45 0 top
R3  26.04,23.08 0 top
R4  2.29,7.08 180 top
R5  26.04,24.61 180 top
R6  79.38,9.62 90 top
R7  12.7,42.39 90 top
R8  44.45,2.29 90 top
R9  47.24,41.15 0 top
R11  47.24,39.62 180 top
R13  2.29,8.73 180 top
R14  26.16,18.26 180 top
R15  47.24,28.42 180 top
R16  54.61,2.29 90 top
R17  52.07,2.29 90 top
R18  49.53,2.29 90 top
R19  46.99,2.29 90 top
R20  42.42,28.42 0 top
R21  38.99,45.85 0 top
R22  38.99,47.24 180 top
R23  41.91,13.18 270 top
R25  42.45,22.86 0 top
R26  47.24,38.13 180 top
R27  41.91,8.73 90 top
RES_B  33.02,22.23 0 top
RESET  33.02,19.68 0 top
RX  30.48,19.68 0 top
SW1  64.77,4.67 270 top
SW2  71.12,4.67 270 top
SWD_CLK  33.02,27.3 0 top
SWD_IO  30.48,27.3 0 top
TFT1  41.27,30.61 270 bottom
TX  30.48,22.23 0 top
U1  25.32,38.6 270 top
U2  26.04,54.83 90 top
U3  47.24,25.62 90 top
U$15  2.54,58.67 0 top
U$16  80.01,58.67 0 top
U$17  2.54,2.54 0 top
U$18  80.01,2.54 0 top
U$20  44.07,50.16 90 top
U$38  7.62,2.54 0 top
U$39  4.83,55.85 0 top
U$40  77.22,4.79 0 top
VIN  51.56,58.64 0 top
X1  13.11,18.71 90 top
Y2  15.24,32.61 0 top

### Tracks (layer width: path | path; a pad name or v marks a point on that pad's centre or on a via)
3.3V  (via drill 0.28)
  Top 0.152: 30.93,31.97 C2.1 30.91,32.16 | 26.07,46.8 C4.1 28.07,45.66 U1.3 | 16.79,35.85 C3.1 16.76,35.82 | C14.1 46.14,22.44 U3.3 46.14,28.17 R15.2 | TFT1.9 TFT1.8 TFT1.7 47.87,21.36 C14.1 | LED1.A v81.28,7.21 | U$20.P6 43.95,51.41 v42.67,51.4 | L2.2 13.74,50.37 v13.72,50.39 | v46.4,21.58 46.4,22.82 C14.1 | R19.1 R18.1 R17.1 R16.1 54.63,1.39 v56.05,1.39 | R27.2 v41.91,10.89 R23.2 | R26.2 v45.21,38.13 | 50.26,38.86 v50.23,38.85 | R22.2 v36.83,47.24 | R21.2 v41.27,45.85 | R7.2 11.47,43.24 v11.43,43.27 | R25.2 43.33,22.83 C14.1 | R13.2 R4.2 1.4,7.04 v1.4,5.56 | 34.19,7.08 v34.21,7.1 | 12.54,2 JP2.1 | v26.89,22.1 v26.89,22.09 | v49.46,41.15 v49.47,41.14
  Top 0.254: TFT1.40 TFT1.41 TFT1.42 50.26,38.86
  Top 0.305: C4.1 v25.4,47.21 C10.1 | U1.48 29.07,32.24 29.34,31.97 30.93,31.97 | U1.7 26.07,46.8 | U1.21 17.88,40.35 C8.1 v18.16,41.5 | U1.30 16.79,35.85 | v16.76,37.69 16.76,35.82 | PRINTER.4 v62.23,59.53 | v30.91,33.14 30.91,32.16
  Top 0.406: v26.04,14.57 C1.1 24.45,13.04 X1.8 | J1.4 34.19,7.08 | v10.79,2 12.54,2 | R3.2 v26.89,22.1 | R9.2 v49.46,41.15
  other vias: 22.86,50.39 20.32,58.01 22.86,58.01 20.32,55.47 17.78,58.01 15.24,58.01 12.7,58.01 12.7,55.47 15.24,55.47 17.78,55.47 20.32,52.93 17.78,52.93 15.24,52.93 12.7,52.93 20.32,50.39
  pour Top (isolate 0.254, no thermals): 11.56,58.64 26.16,58.64 26.16,55.85 30.48,55.85 30.48,53.82 26.16,53.82 26.16,49.12 19.05,49.12 19.05,51.66 11.56,51.66
  pour 3V3 (isolate 0.203): 0,0 82.55,0 82.55,61.21 0,61.21 0,27.94 8.26,27.94 8.26,9.53 0,9.53
ESP_GPIO0  (via drill 0.28)
  Top 0.152: v70.36,4.67 70.36,2.71 SW2.2 | v70.36,4.67 70.32,4.71 SW2.4 70.32,7.42 70.74,7.84 74.8,7.84 80.64,13.68 80.64,54.2 78.11,56.74 67.31,56.74 66.04,55.47 PRINTER.7 | v24.51,29.81 25.57,30.87 U1.41 | v70.36,4.67 73.66,4.67 77.76,8.77 R6.1 | 30.48,24.86 26.8,21.18 17.91,21.18 16.61,22.47 X1.12 16.61,28.77 17.65,29.81 v20.57,29.81
  Top 0.203: 16.26,26.18 X1.12 | G0.TP 30.48,24.86
  Bottom 0.152: v70.36,4.67 25.65,4.67 24.51,5.81 v24.51,29.81 v20.57,29.81
ESP_GPIO5
  Top 0.152: 19.17,37.35 U1.27 17.9,37.35 16.76,38.48 15.37,38.48 11.81,34.92 11.81,30.48 13.59,28.7 14.61,28.7 14.99,28.32 14.99,26.58 X1.13
ESP_GPIO16
  Top 0.152: X1.4 14.23,10.76 14.23,9.01 JP2.4
ESP_RESET  (via drill 0.28)
  Top 0.152: SW1.2 v63.97,4.03 SW1.4 63.97,7.42 64.9,8.35 74.55,8.35 80.14,13.94 80.14,54.07 77.98,56.23 69.34,56.23 68.58,55.47 PRINTER.9 | RESET.TP 30.35,17.24 26.33,17.24 R14.2 14.22,18.26 8.61,12.64 X1.1 8.83,11.43 8.89,11.43 8.51,11.05 8.51,10.16 8.26,9.91 v4.83,9.91 3.65,8.73 R13.1
  Bottom 0.152: v4.83,9.91 4.83,6.48 7.27,4.03 v63.97,4.03
EXT_VIN
  pour Top (isolate 0.254, no thermals): 34.92,56.52 34.92,60.96 59.69,60.96 59.69,56.36 43.18,56.36 43.18,58.64 41.27,58.64 41.27,52.07 39.01,52.07 39.01,56.52
FTDI_VIN
  pour Top (isolate 0.254, rank 2, no thermals): 0.64,48.48 6.6,48.48 6.6,60.93 27.43,60.93 27.43,59.15 8.51,59.15 8.51,46.7 0.64,46.7
GND  (via drill 0.28)
  Top 0.152: U1.4 27.57,45.26 v26.92,45.76
  other vias: 24.13,31.34 15.24,32.64 1.27,28.8 18.41,28.42 12.7,38.96 13.84,42.64 35.56,45.72 41.91,18.13 50.16,22.07 29.84,48.26 11.94,49.75 19.68,47.92 1.27,33.88 10.16,44.04 6.35,33.88 1.27,42.77 8.89,22.45 8.89,18.64 7.62,6.95 5.08,4.41 26.67,2.13 38.73,2.13 57.4,2.13 67.82,2.13 81.28,5.94 73.03,9.49 81.28,16.1 81.28,21.18 81.28,26.26 81.28,31.34 81.28,36.42 81.28,41.5 81.28,46.58 81.28,51.66 81.28,55.47 77.47,60.29 4.83,60.29 58.42,49.12 53.98,47.85 43.81,47.62 49.53,43.18 48.26,32.1 45.97,20.03 40.64,32.61 33.02,43.18 22.86,41.91 28.57,37.47 64.14,9.49 68.58,14.57 56.52,9.62 76.83,14.57 36.32,54.7 36.2,27.3 35.56,31.75 38.1,12.92 30.48,15.34 43.81,7.21 28.57,49.53 73.91,6.7 75.95,2.13 3.17,55.24 51.82,55.34 57.15,52.58 27.3,34.29 19.68,43.78 36.83,39.34 42.55,44.45 60.07,14.57 51.44,14.7 55.24,41.88 55.24,29.81 55.24,19.02 5.71,1.24 62.87,49.12 51.82,54.2 52.96,55.34 59.69,52.58 64.77,54.83 59.69,54.83 32.38,50.8 45.72,13.97 6.35,28.8
  pour Top (isolate 0.203, rank 4): 0,0 82.62,0 82.55,61.21 0,61.21 0,27.3 7.62,27.3 7.62,10.16 0,10.16
  pour GND (isolate 0.203): 0,0 82.55,0 82.55,61.21 0,61.21 0,27.94 8.26,27.94 8.26,9.53 0,9.53
  pour Bottom (isolate 0.203): 0,0 82.62,0 82.55,61.21 0,61.21 0,27.3 7.62,27.3 7.62,10.16 0,10.16
LCD_CS
  Top 0.152: U1.49 41.23,34.85 43.24,36.86 48.26,36.86 | TFT1.38 48.26,36.86 | 48.26,38.3 R26.1 | 48.33,38.37 48.26,38.3 | 48.26,38.3 48.26,36.86
LCD_DC  (via drill 0.28)
  Top 0.152: U1.46 28.07,31.24 28.32,30.99 38.39,30.99 41.78,34.38 42.12,34.72 43.26,35.86 v44.45,35.86 | v46.35,35.86 TFT1.36
  Bottom 0.152: v44.45,35.86 v46.35,35.86
LCD_LITE
  Top 0.152: U1.44 27.07,30.56 27.69,29.94 40.04,29.94 R20.1
LCD_RESET
  Top 0.152: U1.45 27.57,30.85 27.94,30.48 46.03,30.48 R15.1 48.34,28.17 U3.2 50.42,24.5 50.42,23.08 50.64,22.86 TFT1.10 52.86,22.86 57.4,27.4 57.4,46.96 53.98,50.39 44.09,50.39 U$20.P4
MK20_GPIO_2  (via drill 0.28)
  Top 0.152: U1.57 28.74,38.85 v24.77,34.87 | JP2.8 v20.32,5.97
  Bottom 0.152: v20.32,5.97 19.68,6.6 19.68,34.29 20.26,34.87 v24.77,34.87
MK20_GPIO_3  (via drill 0.28)
  Top 0.152: U1.28 20.88,36.85 v25.53,41.5 | v50.32,52.55 54.96,52.55 58.17,55.75 62.87,55.75 63.5,55.12 PRINTER.5
  Bottom 0.152: v25.53,41.5 36.58,52.55 v50.32,52.55
MK20_GPIO_4  (via drill 0.28)
  Top 0.152: U1.29 21.14,36.35 v26.67,41.88 | PRINTER.3 60.96,52.7 60.17,51.91 v50.04,51.91
  Bottom 0.152: v26.67,41.88 36.7,51.91 v50.04,51.91
MK20_GPIO_14  (via drill 0.28)
  Top 0.152: U1.58 28.55,39.35 v24.77,35.56 | v18.67,13.08 18.67,11.27 X1.6 18.61,8.83 JP2.6
  Bottom 0.152: v24.77,35.56 20.32,35.56 19.05,34.29 19.05,13.46 v18.67,13.08
N$1  (via drill 0.28)
  Top 0.152: U1.64 30.31,42.35 v29.21,41.24 | v28.04,18.27 R14.1
  Bottom 0.152: v28.04,18.27 29.21,19.44 v29.21,41.24
N$2
  Top 0.152: 20.11,26.33 X1.10 20.61,24.98 21.08,24.51 25.15,24.51 R5.2
  Top 0.203: 20.32,26.3 X1.10
N$3  (via drill 0.28)
  Top 0.152: v12.7,40.1 R7.1 | U1.23 18.44,39.35 v18.41,39.37
  Bottom 0.152: v18.41,39.37 13.43,39.37 v12.7,40.1
N$4
  Top 0.152: X1.11 18.61,24.54 20.07,23.08 R3.1
N$5
  Top 0.152: X1.3 12.61,9.7 12.31,9.4 5.45,9.4 R4.1
N$7
  Top 0.152: R6.2 81.25,10.47 LED1.C
N$10  (via drill 0.28)
  Top 0.152: Q1.3 41.29,23.17 R25.1 41.6,21.9 v46.35,17.14 | v50.8,17.14 51.44,17.78 51.44,18.13 TFT1.1
  Bottom 0.152: v46.35,17.14 v50.8,17.14
N$11
  Top 0.152: TFT1.2 50.38,18.86 49.53,18 49.53,8.89 54.61,3.81 R16.2
N$12
  Top 0.152: U1.63 37.19,41.85 LED.A
N$13
  Top 0.152: R17.2 52.07,3.81 48.9,6.99 48.9,18.13 50.12,19.36 TFT1.3
N$14
  Top 0.152: R18.2 49.53,3.81 48.26,5.08 48.26,18.38 49.73,19.86 TFT1.4
N$15
  Top 0.152: R19.2 46.99,4.45 47.62,5.08 47.62,18.64 49.34,20.36 TFT1.5
N$16
  Top 0.152: R20.2 43.97,28.42 44.7,27.69 44.7,26.02 Q1.1
N$17
  Top 0.152: TFT1.32 50.53,33.86 50.42,33.75 50.42,33.24 | 50.42,33.24 50.42,32.81 | 50.42,32.81 50.42,32.28 | 50.42,32.28 50.42,31.82 | 50.42,31.82 50.42,31.26 | 50.42,31.26 50.42,30.83 | 50.42,30.83 50.42,30.35 | 50.42,30.35 50.42,29.79 | 50.42,29.79 50.42,29.33 | 50.42,29.33 50.42,28.82 | 50.42,28.82 50.42,28.39 | 50.42,28.39 50.42,27.86 | 50.42,27.86 50.42,27.35 | 50.42,27.35 50.42,26.84 | 50.42,26.84 50.42,26.36 | 50.42,26.36 50.42,25.95 | 50.42,25.95 50.42,25.5 50.55,25.37 TFT1.15 | TFT1.31 50.53,33.36 50.42,33.24 | TFT1.30 50.47,32.86 50.42,32.81 | TFT1.29 50.5,32.36 50.42,32.28 | TFT1.28 50.46,31.86 50.42,31.82 | TFT1.27 50.52,31.36 50.42,31.26 | TFT1.26 50.45,30.86 50.42,30.83 | TFT1.25 50.43,30.36 50.42,30.35 | TFT1.24 50.49,29.86 50.42,29.79 | TFT1.23 50.45,29.36 50.42,29.33 | TFT1.22 50.45,28.86 50.42,28.82 | TFT1.21 50.45,28.36 50.42,28.39 | TFT1.20 50.42,27.86 | 50.42,27.86 | TFT1.19 50.43,27.36 50.42,27.35 | TFT1.18 50.44,26.86 50.42,26.84 | TFT1.17 50.42,26.36 | TFT1.16 50.51,25.86 50.42,25.95
N$18
  Top 0.152: LED.C 39.87,44.39 R2.2
N$27
  Top 0.152: U1.32 18.18,34.85 Y2.3
N$28
  Top 0.152: U1.33 21.57,31.7 20.19,30.32 14.53,30.32 Y2.1
PRINTER_CTS  (via drill 0.28)
  Top 0.152: U1.61 v40.89,40.85 | v66.04,58.13 PRINTER.8
  Bottom 0.152: v40.89,40.85 58.18,58.13 v66.04,58.13
PRINTER_ERASE  (via drill 0.28)
  Top 0.152: U1.53 40.56,36.85 v43.31,39.59 46.36,39.59 R11.2 | v71.12,55.34 PRINTER.11
  Bottom 0.152: v71.12,55.34 70.23,56.23 59.94,56.23 v43.31,39.59
PRINTER_RESET  (via drill 0.28)
  Top 0.152: U1.54 40.17,37.35 v43.94,41.12 46.36,41.12 R9.1 | v73.66,55.34 PRINTER.13
  Bottom 0.152: v73.66,55.34 72.26,56.74 59.56,56.74 v43.94,41.12
PRINTER_RTS  (via drill 0.28)
  Top 0.152: U1.62 v40.39,41.35 | v67.18,59.53 PRINTER.10
  Bottom 0.152: v67.18,59.53 66.29,58.64 57.68,58.64 v40.39,41.35
PRINTER_RX  (via drill 0.28)
  Top 0.152: U1.40 25.07,33.67 26.54,35.15 28.35,35.15 29.84,33.66 v36.2,33.66 | v73.66,58.01 PRINTER.14
  Bottom 0.152: v73.66,58.01 73.03,57.24 59.18,57.24 39.2,37.39 39.02,37.21 37.85,37.21 36.2,35.53 v36.2,33.66
PRINTER_TX  (via drill 0.28)
  Top 0.152: U1.39 24.57,33.84 26.29,35.56 28.7,35.56 30.1,34.16 v35.56,34.16 | v71.12,58.01 PRINTER.12
  Bottom 0.152: v71.12,58.01 70.74,57.63 58.67,57.75 38.61,37.69 37.56,37.69 35.56,35.69 v35.56,34.16
RESET_B  (via drill 0.28)
  Top 0.152: U1.34 22.07,30.29 v20.57,28.8 | R8.2 44.41,3.17 28.32,3.17 27.05,4.45 27.05,7.37 26.42,8 JP2.10 20.32,10.54 20.32,10.92 X1.7 20.57,11.3 v20.57,13.56 23.75,16.73 32.64,16.73 35.05,19.14 35.05,21.68 34.51,22.23 RES_B.TP
  Bottom 0.152: v20.57,28.8 v20.57,13.56
RX2  (via drill 0.28)
  Top 0.152: U1.2 28.57,45.46 29.08,45.97 33.15,45.97 v34.92,44.2 | JP2.9 22.99,2.16 v26.16,5.33
  Bottom 0.152: v34.92,44.2 34.92,14.1 v26.16,5.33
SCL  (via drill 0.28)
  Top 0.152: U1.37 23.57,37.25 v26.67,40.35 | U$20.P3 36.2,49.91 v35.56,49.28 35.56,46.99 36.7,45.85 R21.1
  Bottom 0.152: v26.67,40.35 26.67,40.39 v35.56,49.28
SCL1  (via drill 0.28)
  Top 0.152: U1.55 v33.02,37.85 | v25.15,7.37 22.86,5.08 16.51,5.08 15.24,3.81 JP2.3
  Bottom 0.152: v33.02,37.85 33.02,15.24 v25.15,7.37
SD_CARD_DETECT
  Top 0.152: U1.35 22.57,30.29 23.94,28.92 36.07,28.92 38.1,26.89 38.1,20.95 41.91,17.14 41.91,16.19 | R23.1 41.91,15.88 41.91,16.19 | J1.12 41.91,16.19
SD_CS
  Top 0.152: J1.2 36.39,7.4 36.83,7.84 | U1.43 26.57,30.17 27.3,29.43 36.32,29.43 38.73,27.02 38.73,21.21 41.05,18.89 42.29,18.89 43.18,18 43.18,9.15 R27.1 36.87,7.88
  Top 0.203: 36.83,7.84 36.87,7.88
SDA  (via drill 0.28)
  Top 0.152: U1.38 24.07,36.99 v27.94,40.86 | v36.45,49.4 40.01,49.4 | 40.01,49.4 U$20.P2 | R22.1 40.01,47.24 40.01,49.4
  Bottom 0.152: v27.94,40.86 27.94,40.89 v36.45,49.4
SDA1  (via drill 0.28)
  Top 0.152: JP2.5 17.78,4.19 18.16,4.57 23.37,4.57 v26.16,7.37 | U1.56 33.65,38.35 v33.66,38.35
  Bottom 0.152: v26.16,7.37 33.66,14.86 v33.66,38.35
SPI_CLK  (via drill 0.28)
  Top 0.152: U1.50 40.71,35.35 v41.73,36.37 | J1.5 33.09,8.42 v33.15,8.48 | v45.09,32.23 v45.09,36.37 45.04,36.36 TFT1.37
  Bottom 0.152: v41.73,36.37 v45.09,36.37 | v45.09,32.23 36.2,23.34 36.2,11.53 v33.15,8.48
SPI_MISO  (via drill 0.28)
  Top 0.152: TFT1.33 v45.72,34.36 | U1.52 v38.15,36.35 | J1.7 30.89,8.25 v30.86,8.48
  Bottom 0.152: v38.15,36.35 40.14,34.36 v45.72,34.36 45.72,33.88 35.56,23.72 35.56,13.18 v30.86,8.48
SPI_MOSI  (via drill 0.28)
  Top 0.152: TFT1.34 46.37,34.86 v46.35,34.87 | U1.51 v39.62,35.85 | v35.31,8.6 35.31,6.12 J1.3
  Bottom 0.152: v39.62,35.85 39.62,35.83 40.59,34.87 v46.35,34.87 46.35,32.61 36.83,23.08 36.83,10.13 v35.31,8.6
SWD_CLK  (via drill 0.28)
  Top 0.152: X1.14 12.61,28.25 10.79,30.07 10.79,35.27 15.37,39.85 U1.22 21.3,39.85 v21.34,39.88 | v28.57,26.04 31.75,26.04 SWD_CLK.TP
  Bottom 0.152: v21.34,39.88 24.89,39.88 28.57,36.2 v28.57,26.04
SWD_IO  (via drill 0.28)
  Top 0.152: v16.61,13.28 X1.5 | v14.35,28.16 13.34,28.16 11.3,30.19 11.3,35.15 15.14,38.99 17.02,38.99 17.65,38.35 U1.25 v21.33,38.35 v21.34,38.35 | v27.94,27.3 SWD_IO.TP
  Bottom 0.152: v14.35,28.16 14.35,15.54 v16.61,13.28 | v21.34,38.35 25.15,38.35 27.94,35.56 v27.94,27.3
TOUCH_INT  (via drill 0.28)
  Top 0.152: U1.36 23.07,37.52 v26.67,41.12 | v36.45,50.93 44.05,50.93 U$20.P5
  Bottom 0.152: v26.67,41.12 26.67,41.15 v36.45,50.93
TX2  (via drill 0.28)
  Top 0.152: U1.1 29.07,45.2 29.46,45.59 32.51,45.59 v34.29,43.81 | v26.16,6.35 23.5,3.68 20.83,3.68 20.32,3.17 JP2.7
  Bottom 0.152: v34.29,43.81 34.29,14.48 v26.16,6.35
UART2_RX  (via drill 0.28)
  Top 0.152: U1.59 28.32,39.85 v24.77,36.29 | FTDI.2 7.24,42.51 8.51,41.24 v8.51,36.29 8.51,26.23 X1.16 8.61,24.25 12.62,20.24 12.95,19.91 13.18,19.68 RX.TP
  Top 0.203: 8.26,26.18 X1.16
  Bottom 0.152: v24.77,36.29 v8.51,36.29
UART2_TX  (via drill 0.28)
  Top 0.152: U1.60 28.11,40.35 v24.77,37 | FTDI.3 7.62,45.05 10.23,42.44 v10.23,37 10.23,26.59 X1.15 10.61,23.52 13.59,20.54 28.8,20.54 TX.TP
  Top 0.203: 10.16,26.14 X1.15
  Bottom 0.152: v24.77,37 v10.23,37
VCC
  pour Top (isolate 0.254, rank 2, no thermals): 27.94,60.93 34.42,60.93 34.42,54.83 30.61,54.83 30.61,56.1 27.94,56.1
VDDA
  Top 0.152: U1.13 23.07,45.1 21.38,46.79 C5.1 17.14,48.06 R1.1 16.68,48.53 L2.1
VREF_OUT
  Top 0.152: U1.17 17.78,42.35 C7.1
VREFH
  Top 0.152: U1.14 22.57,44.96 21.59,45.94 15.46,45.94 C6.1 14.61,48.06 R1.2
VREFL
  Top 0.152: U1.16 21.57,44.82 21.34,45.05 17.18,45.05 C5.2 C6.2 | C6.2 L1.2 | C6.2 14.61,43.82 C7.2
  Top 0.203: U1.15 U1.16

### Text on the board
tPlace: POWER | + | - | ° | ° | Printrhub Rev 0.4 | RESET | GPIO0 | EXP | ° | DNI